# EAGLE design Radio_RPIZero (EAGLE 9.2.0)
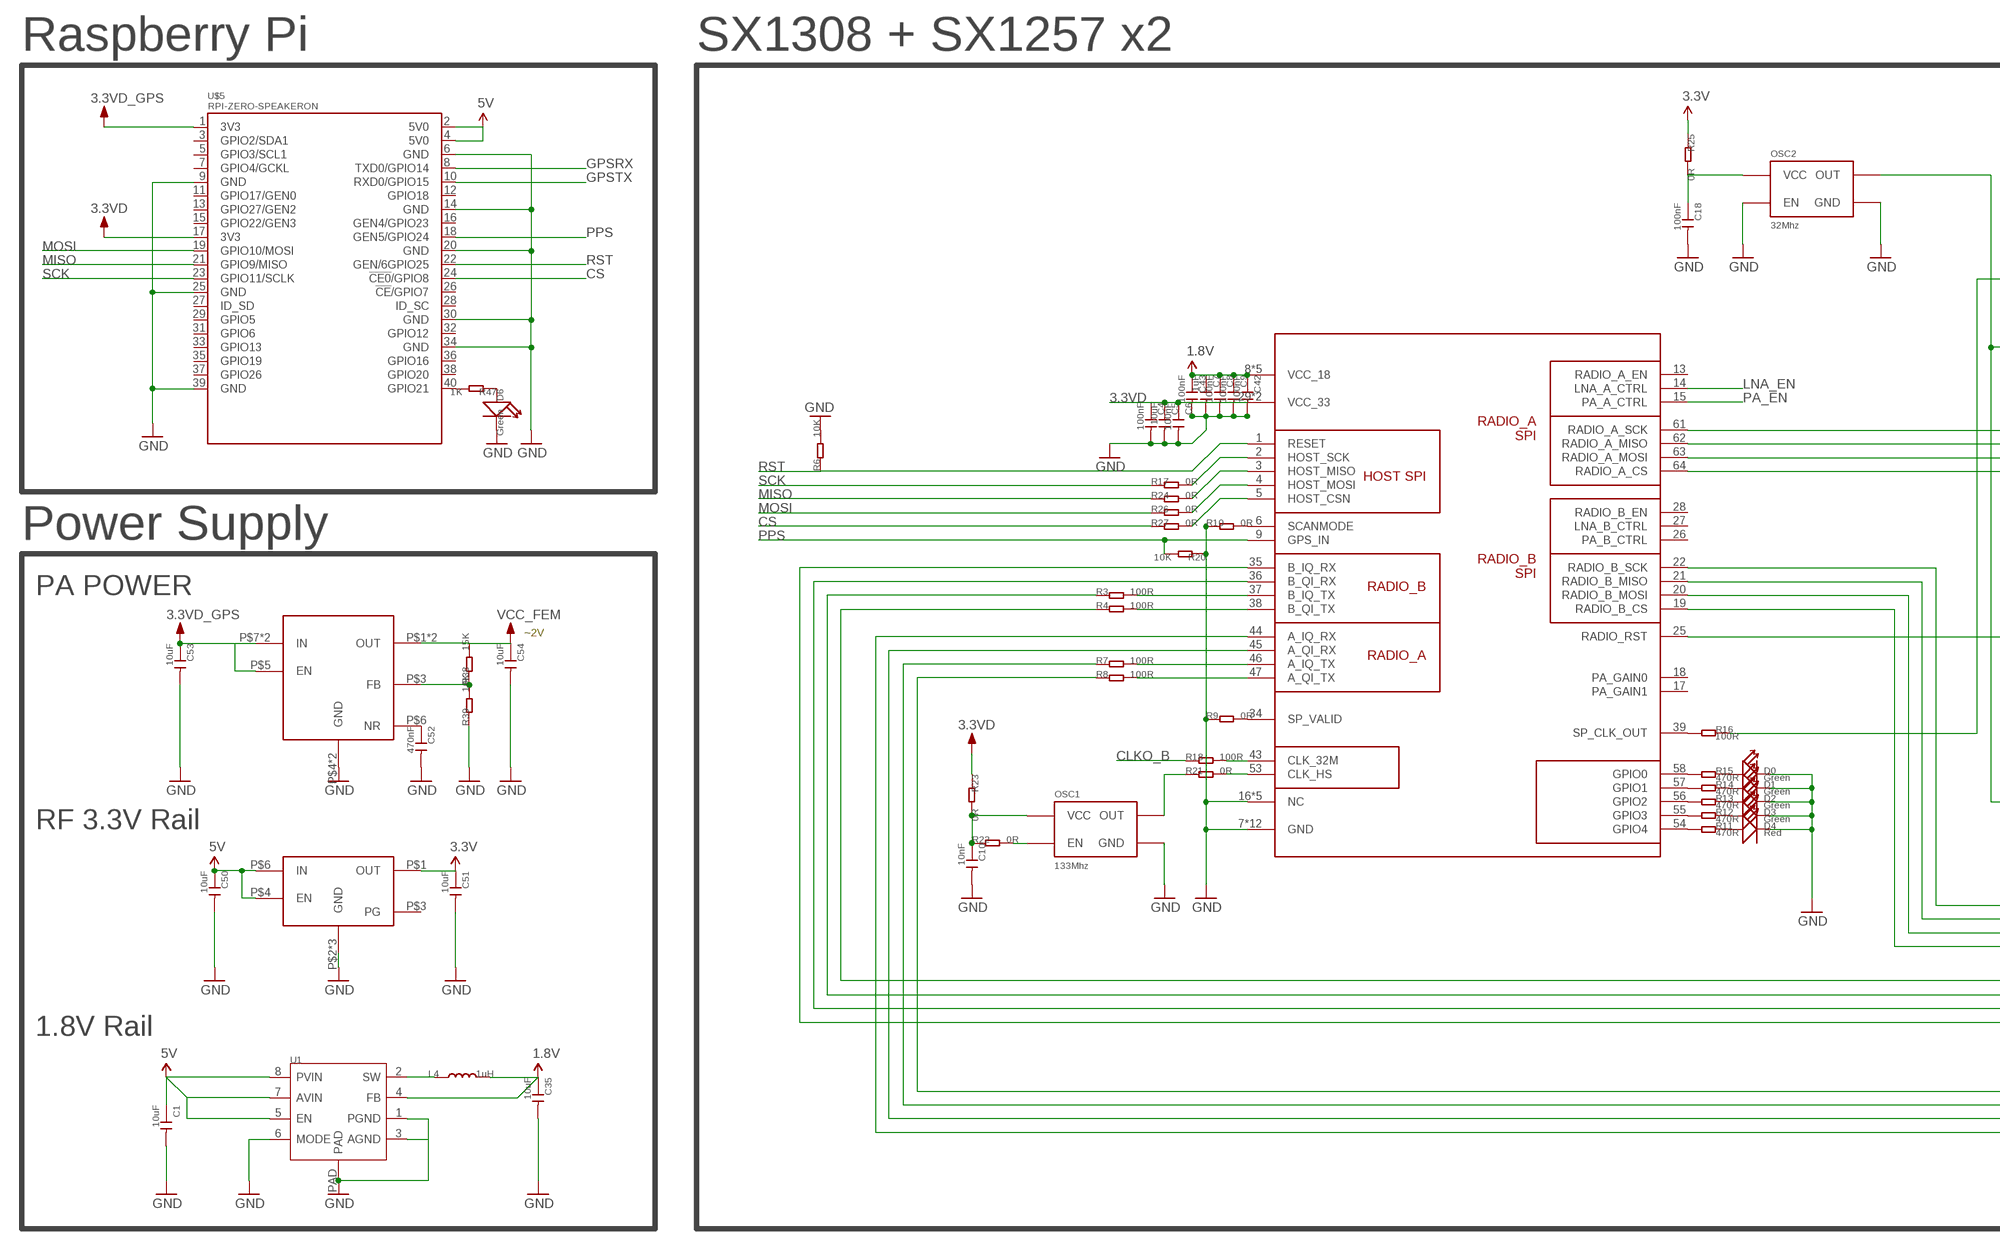
[diagram p0: schematic, sheet 1, part 1 of 2]
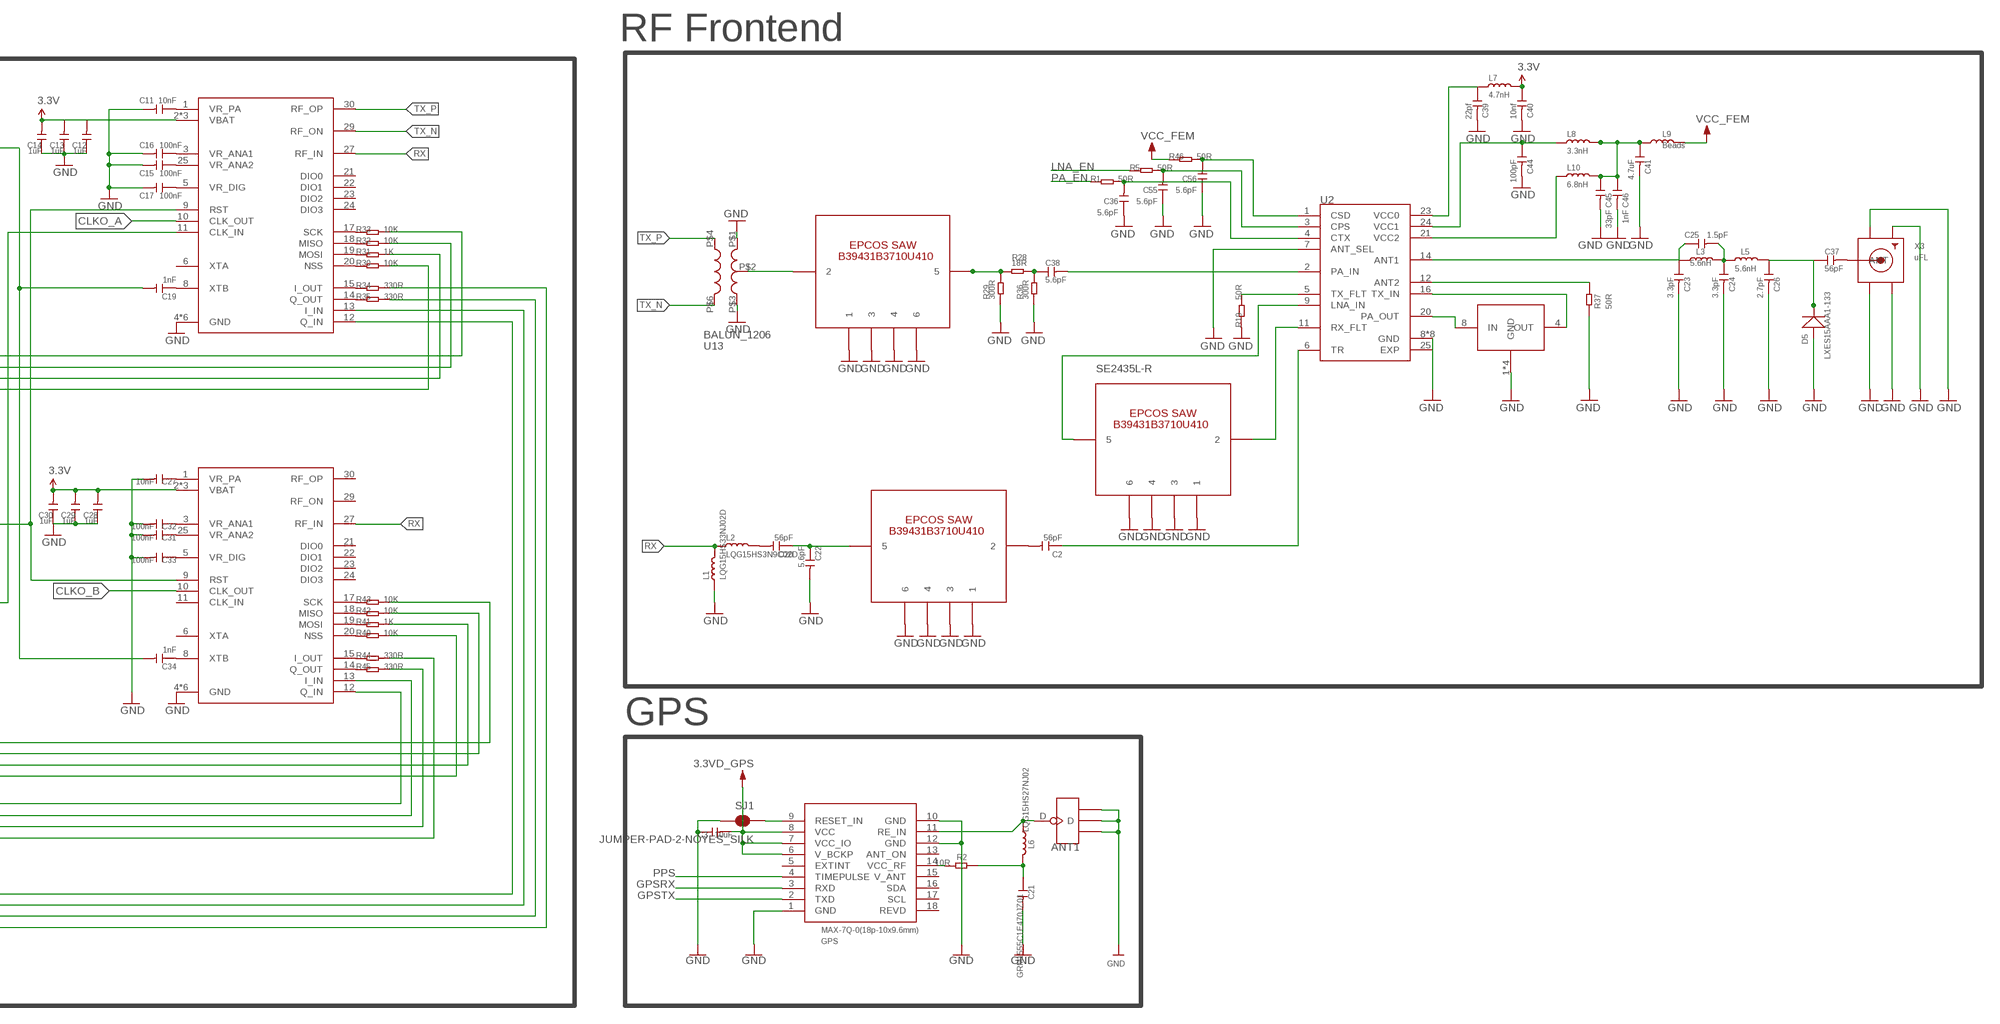
[diagram p1: schematic, sheet 1, part 2 of 2]

## Parts
ANT1  ANTENNA-U-FL  [4P-U-FL]
C1  10uF  CAP-0603  [C0603@1]
C2  56pF  CAP-0402  [C0402@1]
C3  10uF  C-0603  [C0603]
C4  100nF  CAP-0402  [C0402@1]
C5  10uF  CAP-0402  [C0402@1]
C6  100nF  CAP-0402  [C0402@1]
C7  1uF  CAP-0402  [C0402@1]
C8  100nF  CAP-0402  [C0402@1]
C9  100nF  CAP-0402  [C0402@1]
C10  10nF  CAP-0402  [C0402@1]
C11  10nF  CAP-0402  [C0402@1]
C12  1uF  CAP-0402  [C0402@1]
C13  1uF  CAP-0402  [C0402@1]
C14  1uF  CAP-0402  [C0402@1]
C15  100nF  CAP-0402  [C0402@1]
C16  100nF  CAP-0402  [C0402@1]
C17  100nF  CAP-0402  [C0402@1]
C18  100nF  CAP-0402  [C0402@1]
C19  1nF  CAP-0402  [C0402@1]
C20  56pF  CAP-0402  [C0402@1]
C21  GRM1555C1E470JZ01  C-0402  [C0402]
C22  5.6pF  CAP-0402  [C0402@1]
C23  3.3pF  CAP-0402  [C0402@1]
C24  3.3pF  CAP-0402  [C0402@1]
C25  1.5pF  CAP-0402  [C0402@1]
C26  2.7pF  CAP-0402  [C0402@1]
C27  10nF  CAP-0402  [C0402@1]
C28  1uF  CAP-0402  [C0402@1]
C29  1uF  CAP-0402  [C0402@1]
C30  1uF  CAP-0402  [C0402@1]
C31  100nF  CAP-0402  [C0402@1]
C32  100nF  CAP-0402  [C0402@1]
C33  100nF  CAP-0402  [C0402@1]
C34  1nF  CAP-0402  [C0402@1]
C35  10uF  CAP-0603  [C0603@1]
C36  5.6pF  CAP-0402  [C0402@1]
C37  56pF  CAP-0402  [C0402@1]
C38  5.6pF  CAP-0402  [C0402@1]
C39  22pf  CAP-0402  [C0402@1]
C40  10nf  CAP-0402  [C0402@1]
C41  4.7uF  CAP-0402  [C0402@1]
C42  100nF  CAP-0402  [C0402@1]
C43  100nF  CAP-0402  [C0402@1]
C44  100pF  CAP-0402  [C0402@1]
C45  33pF  CAP-0402  [C0402@1]
C46  1nF  CAP-0402  [C0402@1]
C50  10uF  CAP-0603  [C0603@1]
C51  10uF  CAP-0603  [C0603@1]
C52  470nF  CAP-0402  [C0402@1]
C53  10uF  CAP-0402  [C0402@1]
C54  10uF  CAP-0402  [C0402@1]
C55  5.6pF  CAP-0402  [C0402@1]
C56  5.6pF  CAP-0402  [C0402@1]
D0  Green  LED-0603  [LED-0603@1]
D1  Green  LED-0603  [LED-0603@1]
D2  Green  LED-0603  [LED-0603@1]
D3  Green  LED-0603  [LED-0603@1]
D4  Red  LED-0603  [LED-0603@1]
D5  LXES15AAA1-133  D  [C0402]
D6  Green  LED'0603'  [LED-0603]
GPS  MAX-7Q-0(18p-10x9.6mm)  MODULE-GPS-SMD-MAX-7Q-0(18P-9.6X10MM)  [GPS18P-SMD-1.1-10X9.6MM]
L1  LQG15HS33NJ02D  INDUCTOR/FERRITE-BEAD-0402  [L0402@1]
L2  LQG15HS3N9C02D  INDUCTOR/FERRITE-BEAD-0402  [L0402@1]
L3  5.6nH  INDUCTOR/FERRITE-BEAD-0402  [L0402@1]
L4  1uH  L'1616BZ'  [1616BZ]
L5  5.6nH  INDUCTOR/FERRITE-BEAD-0402  [L0402@1]
L6  LQG15HS27NJ02  L'0402'  [L0402]
L7  4.7nH  INDUCTOR/FERRITE-BEAD-0402  [L0402@1]
L8  3.3nH  INDUCTOR/FERRITE-BEAD-0402  [L0402@1]
L9  Beads  INDUCTOR/FERRITE-BEAD-0402  [L0402@1]
L10  6.8nH  INDUCTOR/FERRITE-BEAD-0402  [L0402@1]
OSC1  133Mhz  OSCILLATOR3225  [CRYSTAL-OSC-SMD-2.0X2.5]
OSC2  32Mhz  OSCILLATOR  [CRYSTAL-OSC-SMD-3.2X2.5]
R1  50R  R-0402  [R0402]
R2  10R  R-0402  [R0402]
R3  100R  R-0402  [R0402]
R4  100R  R-0402  [R0402]
R5  50R  R-0402  [R0402]
R6  10K  R-0402  [R0402]
R7  100R  R-0402  [R0402]
R8  100R  R-0402  [R0402]
R9  0R  R-0402  [R0402]
R10  0R  R-0402  [R0402]
R11  470R  R-0402  [R0402]
R12  470R  R-0402  [R0402]
R13  470R  R-0402  [R0402]
R14  470R  R-0402  [R0402]
R15  470R  R-0402  [R0402]
R16  100R  R-0402  [R0402]
R17  0R  R-0402  [R0402]
R18  100R  R-0402  [R0402]
R19  50R  R-0402  [R0402]
R20  10K  R-0402  [R0402]
R21  0R  R-0402  [R0402]
R22  0R  R-0402  [R0402]
R23  0R  R-0402  [R0402]
R24  0R  R-0402  [R0402]
R25  0R  R-0402  [R0402]
R26  0R  R-0402  [R0402]
R27  0R  R-0402  [R0402]
R28  18R  R-0402  [R0402]
R29  300R  R-0402  [R0402]
R30  10K  R-0402  [R0402]
R31  1K  R-0402  [R0402]
R32  10K  R-0402  [R0402]
R33  10K  R-0402  [R0402]
R34  330R  R-0402  [R0402]
R35  330R  R-0402  [R0402]
R36  300R  R-0402  [R0402]
R37  50R  R-0402  [R0402]
R38  15K  R-0402  [R0402]
R39  10K  R-0402  [R0402]
R40  10K  R-0402  [R0402]
R41  1K  R-0402  [R0402]
R42  10K  R-0402  [R0402]
R43  10K  R-0402  [R0402]
R44  330R  R-0402  [R0402]
R45  330R  R-0402  [R0402]
R46  50R  R-0402  [R0402]
R47  1K  R-0402  [R0402]
SJ1  JUMPER-PAD-2-NOYES_SILK  [PAD-JUMPER-2-NO_YES_SILK]
U1  PMIC-ETA3410D2I-T(DFN8-2X2)WSON  [WSON]
U2  SE2435L-R  [QFN50P400X400X90-25N]
U13  BALUN_1206  [BALUN_1206]
U$1  SX1301  [QFN64G-0.5-9X9MM]
U$2  SX1255  [QFN32G-0.5-5X5MM]
U$3  SX1255  [QFN32G-0.5-5X5MM]
U$4  B39921B3728U410  EPCOS_SAW_FILTER  [EPCOS_SAW_FILTER]
U$5  RPI-ZERO-SPEAKERON  [RASPBERRYPI_BASTELSTUBE_V13_RASPI_BOARD_B+_FULL]
U$6  LP5912  [WSON6]
U$7  B39921B3728U410  EPCOS_SAW_FILTER  [EPCOS_SAW_FILTER]
U$8  B39921B3728U410  EPCOS_SAW_FILTER  [EPCOS_SAW_FILTER]
U$9  TPS7A8101  [VSON8]
U$10  0915LP15B026  [0915LP15B026]
X3  uFL  SMACONNECTOR_EDGE_UFL  [SMA_EDGELAUNCH_UFL]

## Nets
1.8V: C7.1 C8.1 C9.1 C35.1 C42.1 C43.1 L4.2 U1.4(FB) U$1.8(VCC_18) U$1.12(VCC_18) U$1.23(VCC_18) U$1.42(VCC_18) U$1.60(VCC_18)
3.3V: C12.2 C13.2 C14.2 C28.2 C29.2 C30.2 C40.1 C51.1 L7.2 R25.1 U$2.2(VBAT) U$2.16(VBAT) U$2.32(VBAT) U$3.2(VBAT) U$3.16(VBAT) U$3.32(VBAT) U$6.P$1(OUT)
3.3VD: C4.1 C5.1 C6.1 R23.1 U$1.29(VCC_33) U$1.52(VCC_33) U$5.17(3V3)
3.3VD_GPS: C3.2 C53.1 GPS.6(V_BCKP) GPS.7(VCC_IO) GPS.8(VCC) U$5.1(3V3) U$9.P$5(EN) U$9.P$7(IN) U$9.P$8(IN)
5V: C1.1 C50.1 U1.5(EN) U1.7(AVIN) U1.8(PVIN) U$5.2(5V0) U$5.4(5V0) U$6.P$4(EN) U$6.P$6(IN)
CLKO_A: U$2.10(CLK_OUT)
CLKO_B: R18.1 U$3.10(CLK_OUT)
CS: R27.1 U$5.24(!CE0!/GPIO8)
FEWF: D4.+ R11.2
GND: ANT1.GND1 ANT1.GND2 ANT1.GND3 C1.2 C3.1 C4.2 C5.2 C6.2 C7.2 C8.2 C9.2 C10.2 C11.2 C12.1 C13.1 C14.1 C15.2 C16.2 C17.2 C18.2 C21.2 C22.2 C23.2 C24.2 C26.2 C27.2 C28.1 C29.1 C30.1 C31.2 C32.2 C33.2 C35.2 C36.1 C39.2 C40.2 C41.2 C42.2 C43.2 C44.2 C45.2 C46.2 C50.2 C51.2 C52.2 C53.2 C54.2 C55.1 C56.1 D0.- D1.- D2.- D3.- D4.- D5.1(+) D6.- GPS.1(GND) GPS.10(GND) GPS.12(GND) L1.1 OSC1.2(GND) OSC2.P$1(EN) OSC2.P$2(GND) R6.2 R9.1 R10.1 R19.1 R20.1 R29.1 R36.1 R37.2 R39.1 SJ1.2 U1.1(PGND) U1.3(AGND) U1.6(MODE) U1.PAD U2.7(ANT_SEL) U2.8(GND) U2.10(GND) U2.13(GND) U2.15(GND) U2.17(GND) U2.18(GND) U2.19(GND) U2.22(GND) U2.25(EXP) U13.P$1(GND_1) U13.P$3(GND_2) U$1.7(GND) U$1.10(GND) U$1.11(GND) U$1.16(NC) U$1.24(GND) U$1.30(GND) U$1.31(GND) U$1.32(NC) U$1.33(NC) U$1.40(GND) U$1.41(GND) U$1.48(NC) U$1.49(NC) U$1.50(GND) U$1.51(GND) U$1.59(GND) U$1.65(GND) U$2.4(GND) U$2.7(GND) U$2.26(GND) U$2.28(GND) U$2.31(GND) U$2.33(GND) U$3.4(GND) U$3.7(GND) U$3.26(GND) U$3.28(GND) U$3.31(GND) U$3.33(GND) U$4.P$1 U$4.P$3 U$4.P$4 U$4.P$6 U$5.6(GND) U$5.9(GND) U$5.14(GND) U$5.20(GND) U$5.25(GND) U$5.30(GND) U$5.34(GND) U$5.39(GND) U$6.P$2(GND) U$6.P$5(GND) U$6.PAD(GND) U$7.P$1 U$7.P$3 U$7.P$4 U$7.P$6 U$8.P$1 U$8.P$3 U$8.P$4 U$8.P$6 U$9.P$4(GND) U$9.PAD(GND) U$10.1(GND) U$10.3(GND) U$10.5(GND) U$10.7(GND) X3.GND@1(GND1) X3.GND@2(GND2) X3.GND@3(GND3) X3.GND@4(GND4)
GPSRX: GPS.3(RXD) U$5.8(TXD0/GPIO14)
GPSTX: GPS.2(TXD) U$5.10(RXD0/GPIO15)
LNA_EN: R5.1 U$1.14(LNA_A_CTRL)
MISO: R24.1 U$5.21(GPIO9/MISO)
MOSI: R26.1 U$5.19(GPIO10/MOSI)
N$1: R30.1 U$2.20(NSS)
N$2: R45.2 U$1.36(B_QI_RX)
N$3: R3.2 U$1.37(B_IQ_TX)
N$4: R4.2 U$1.38(B_QI_TX)
N$5: R34.2 U$1.44(A_IQ_RX)
N$6: R7.2 U$1.46(A_IQ_TX)
N$7: R8.2 U$1.47(A_QI_TX)
N$8: R35.2 U$1.45(A_QI_RX)
N$9: R9.2 U$1.34(SP_VALID)
N$10: R10.2 U$1.6(SCANMODE)
N$11: C20.2 L2.2
N$12: R11.1 U$1.54(GPIO4)
N$13: R12.1 U$1.55(GPIO3)
N$14: R13.1 U$1.56(GPIO2)
N$15: R14.1 U$1.57(GPIO1)
N$16: R15.1 U$1.58(GPIO0)
N$17: U2.20(PA_OUT) U$10.8(IN)
N$18: D3.+ R12.2
N$19: D1.+ R14.2
N$20: D0.+ R15.2
N$21: D2.+ R13.2
N$22: R16.1 U$1.39(SP_CLK_OUT)
N$23: U13.P$2(UNBALANCE) U$7.P$2
N$25: L4.1 U1.2(SW)
N$26: R47.2 U$5.40(GPIO21)
N$27: C21.1 L6.1 R2.1
N$28: C36.2 R1.2 U2.4(CTX)
N$29: C19.1 U$2.8(XTB)
N$30: R21.2 U$1.53(CLK_HS)
N$31: OSC1.3(OUT) R21.1
N$32: OSC1.1(EN) R22.2
N$33: C10.1 OSC1.4(VCC) R22.1 R23.2
N$34: GPS.14(VCC_RF) R2.2
N$35: C11.1 U$2.1(VR_PA)
N$36: C18.1 OSC2.P$4(VCC) R25.2
N$37: C19.2 C34.2 OSC2.P$3(OUT)
N$38: C15.1 U$2.25(VR_ANA2)
N$39: C16.1 U$2.3(VR_ANA1)
N$40: C17.1 U$2.5(VR_DIG)
N$41: ANT1.D GPS.11(RE_IN) L6.2
N$42: R19.2 U2.5(TX_FLT)
N$43: R17.2 U$1.2(HOST_SCK)
N$44: C20.1 C22.1 U$4.P$5
N$45: R18.2 U$1.43(CLK_32M)
N$46: C2.2 U$4.P$2
N$47: GPS.9(RESET_IN) SJ1.1
N$48: R24.2 U$1.3(HOST_MISO)
N$50: R26.2 U$1.4(HOST_MOSI)
N$51: C55.2 R5.2 U2.3(CPS)
N$52: R28.1 R29.2 U$7.P$5
N$53: U2.11(RX_FLT) U$8.P$2
N$54: U2.9(LNA_IN) U$8.P$5
N$56: R34.1 U$2.15(I_OUT)
N$57: R35.1 U$2.14(Q_OUT)
N$58: C27.1 U$3.1(VR_PA)
N$59: C31.1 U$3.25(VR_ANA2)
N$60: C32.1 U$3.3(VR_ANA1)
N$61: C33.1 U$3.5(VR_DIG)
N$62: C34.1 U$3.8(XTB)
N$64: C2.1 U2.6(TR)
N$65: C23.1 C25.1 L3.1 U2.14(ANT1)
N$66: C24.1 C25.2 L3.2 L5.1
N$67: C26.1 C37.1 D5.2(-) L5.2
N$68: C38.1 R28.2 R36.2
N$69: C38.2 U2.2(PA_IN)
N$70: C37.2 X3.P(ANT)
N$71: C39.1 L7.1 U2.23(VCC0)
N$72: R37.1 U2.12(ANT2)
N$73: U2.16(TX_IN) U$10.4(OUT)
N$74: C41.1 C45.1 C46.1 L8.2 L9.1 L10.2
N$75: C44.1 L8.1 U2.24(VCC1)
N$76: D6.+ R47.1
N$77: L10.1 U2.21(VCC2)
N$78: R44.1 U$3.15(I_OUT)
N$79: R45.1 U$3.14(Q_OUT)
N$80: R33.2 U$1.61(RADIO_A_SCK)
N$81: R32.2 U$1.62(RADIO_A_MISO)
N$82: R31.2 U$1.63(RADIO_A_MOSI)
N$83: R30.2 U$1.64(RADIO_A_CS)
N$84: R43.2 U$1.22(RADIO_B_SCK)
N$85: R42.2 U$1.21(RADIO_B_MISO)
N$86: R41.2 U$1.20(RADIO_B_MOSI)
N$87: R40.2 U$1.19(RADIO_B_CS)
N$88: U$1.25(RADIO_RST) U$2.9(RST) U$3.9(RST)
N$89: R16.2 U$2.11(CLK_IN)
N$90: R44.2 U$1.35(B_IQ_RX)
N$91: R7.1 U$2.13(I_IN)
N$92: R3.1 U$3.13(I_IN)
N$93: R4.1 U$3.12(Q_IN)
N$94: R8.1 U$2.12(Q_IN)
N$95: C56.2 R46.2 U2.1(CSD)
N$96: R38.1 R39.2 U$9.P$3(FB)
N$97: R27.2 U$1.5(HOST_CSN)
N$98: C52.1 U$9.P$6(NR)
N$100: R31.1 U$2.19(MOSI)
N$101: R32.1 U$2.18(MISO)
N$102: R33.1 U$2.17(SCK)
N$103: R40.1 U$3.20(NSS)
N$104: R41.1 U$3.19(MOSI)
N$105: R42.1 U$3.18(MISO)
N$106: R43.1 U$3.17(SCK)
PA_EN: R1.1 U$1.15(PA_A_CTRL)
PPS: GPS.4(TIMEPULSE) R20.2 U$1.9(GPS_IN) U$5.18(GEN5/GPIO24)
RST: R6.1 U$1.1(RESET) U$5.22(GEN/6GPIO25)
RX: L1.2 L2.1 U$2.27(RF_IN) U$3.27(RF_IN)
SCK: R17.1 U$5.23(GPIO11/SCLK)
TX_N: U13.P$6(BALANCE_2) U$2.29(RF_ON)
TX_P: U13.P$4(BALANCE_1) U$2.30(RF_OP)
VCC_FEM: C54.1 L9.2 R38.2 R46.1 U$9.P$1(OUT) U$9.P$2(OUT)
Unconnected: GPS.5(EXTINT) GPS.13(ANT_ON) GPS.15(V_ANT) GPS.16(SDA) GPS.17(SCL) GPS.18(REVD) U$1.13(RADIO_A_EN) U$1.17(PA_GAIN1) U$1.18(PA_GAIN0) U$1.26(PA_B_CTRL) U$1.27(LNA_B_CTRL) U$1.28(RADIO_B_EN) U$2.6(XTA) U$2.21(DIO0) U$2.22(DIO1) U$2.23(DIO2) U$2.24(DIO3) U$3.6(XTA) U$3.11(CLK_IN) U$3.21(DIO0) U$3.22(DIO1) U$3.23(DIO2) U$3.24(DIO3) U$3.29(RF_ON) U$3.30(RF_OP) U$5.3(GPIO2/SDA1) U$5.5(GPIO3/SCL1) U$5.7(GPIO4/GCKL) U$5.11(GPIO17/GEN0) U$5.12(GPIO18) U$5.13(GPIO27/GEN2) U$5.15(GPIO22/GEN3) U$5.16(GEN4/GPIO23) U$5.26(!CE!/GPIO7) U$5.27(ID_SD) U$5.28(ID_SC) U$5.29(GPIO5) U$5.31(GPIO6) U$5.32(GPIO12) U$5.33(GPIO13) U$5.35(GPIO19) U$5.36(GPIO16) U$5.37(GPIO26) U$5.38(GPIO20) U$6.P$3(PG)

## Notes on the sheet
- Raspberry Pi | SX1308 + SX1257 x2 | RF Frontend
- Power Supply
- PA POWER
- ~2V
- RF 3.3V Rail
- GPS
- 1.8V Rail

## Library data of the parts
ANT1 = Connector :ANTENNA-U-FL
C1 C2 C4-C20 C22-C46 C50-C56 = Discrete:CAP: Ceramic Capacitors
C3 C21 = Discrete:C*: Ceramic Capacitors
D0 D1-D4 = Discrete:LED
D5 = Discrete:D*
D6 = Discrete:LED*
GPS = Seeed-OPL-Moudle:MODULE-GPS-SMD-MAX-7Q-0(18P-9.6X10MM): 317050009; MPN: MAX-7Q-0
L1-L3 L5 L7-L10 = Discrete:INDUCTOR/FERRITE-BEAD
L4 L6 = Discrete:L*
OSC1 OSC2 = SparkFun-FreqCtrl:OSCILLATOR: Generic 5x3 and 7x5 oscillators
R1-R47 = Discrete:R*
SJ1 = SparkFun-Passives:JUMPER-PAD-2-NO
U1 = Seeed-OPL-ic:PMIC-ETA3410D2I-T(DFN8-2X2): 310030161
U2 = SE2435L-R:SE2435L-R: LNA/PA RF Front End 16dB 2dB 24-Pin QFN EP T/R; DESCRIPTION: LNA/PA RF Front End 16dB 2dB 24-Pin QFN EP T/R; DIGI-KEY_PART_NUMBER: 863-1349-1-ND; DIGI-KEY_PURCHASE_URL: https://www.digikey.tw/product-detail/en/skyworks-solutions-inc/SE2435L-R/863-1349-1-ND/2745468?WT.z_cid=ref_snapeda&utm_source=snapeda&utm_medium=aggregator&utm_campaign=buynow; MF: Skyworks Solutions; MP: SE2435L-R; PACKAGE: QFN-24 Skyworks Solutions
U13 = SparkFun-RF:BALUN_1206
U$1 = Seeed-OPL-ic:SX1301
U$2 U$3 = Seeed-OPL-ic:SX1255
U$4 U$7 U$8 = Ava:EPCOS_SAW_FILTER
U$5 = jos-ph:RPI-ZERO-SPEAKERON: Raspberry Pi Zero for SPEAKER ON
U$6 = IC:LP5912
U$9 = IC:TPS7A8101
U$10 = SparkFun-RF:0915LP15B026
X3 = microbuilder:SMACONNECTOR: SMA Connector 90° DIP SMA Connector, 50 Ohm (4UConnector: 07259)

## Board
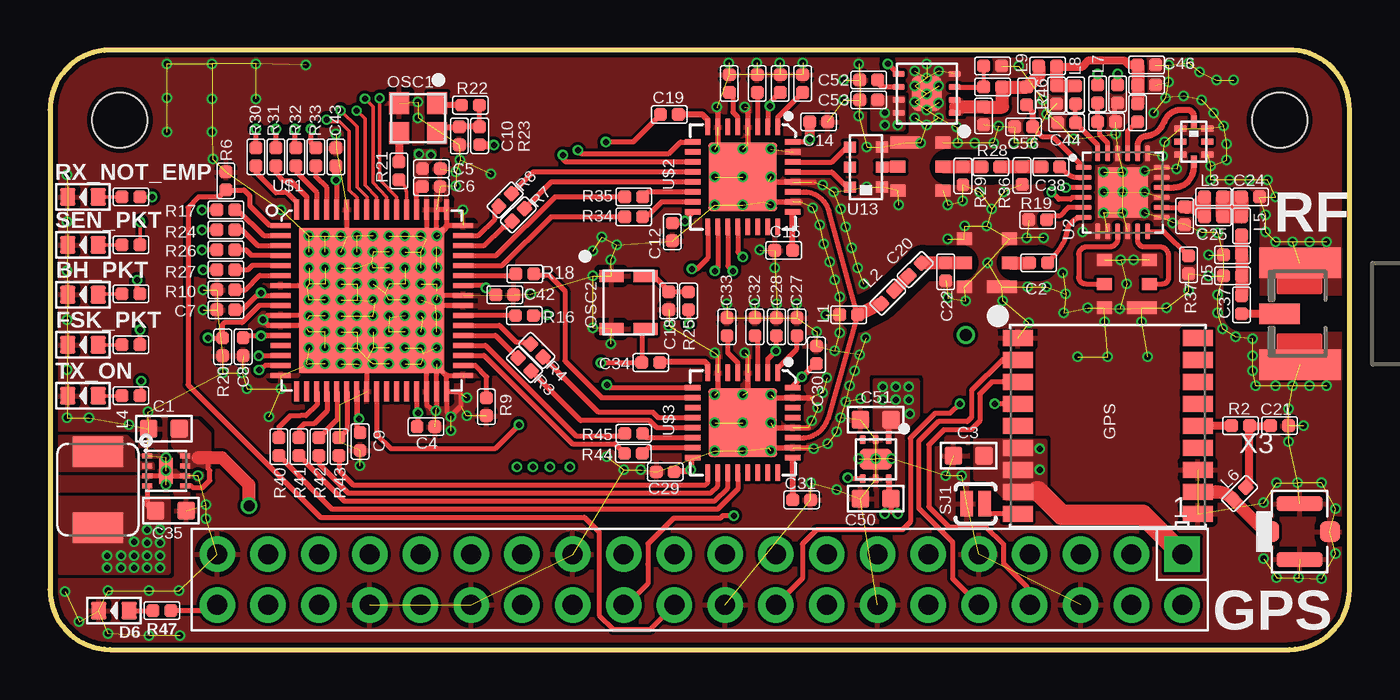
[diagram p2: board, top side]
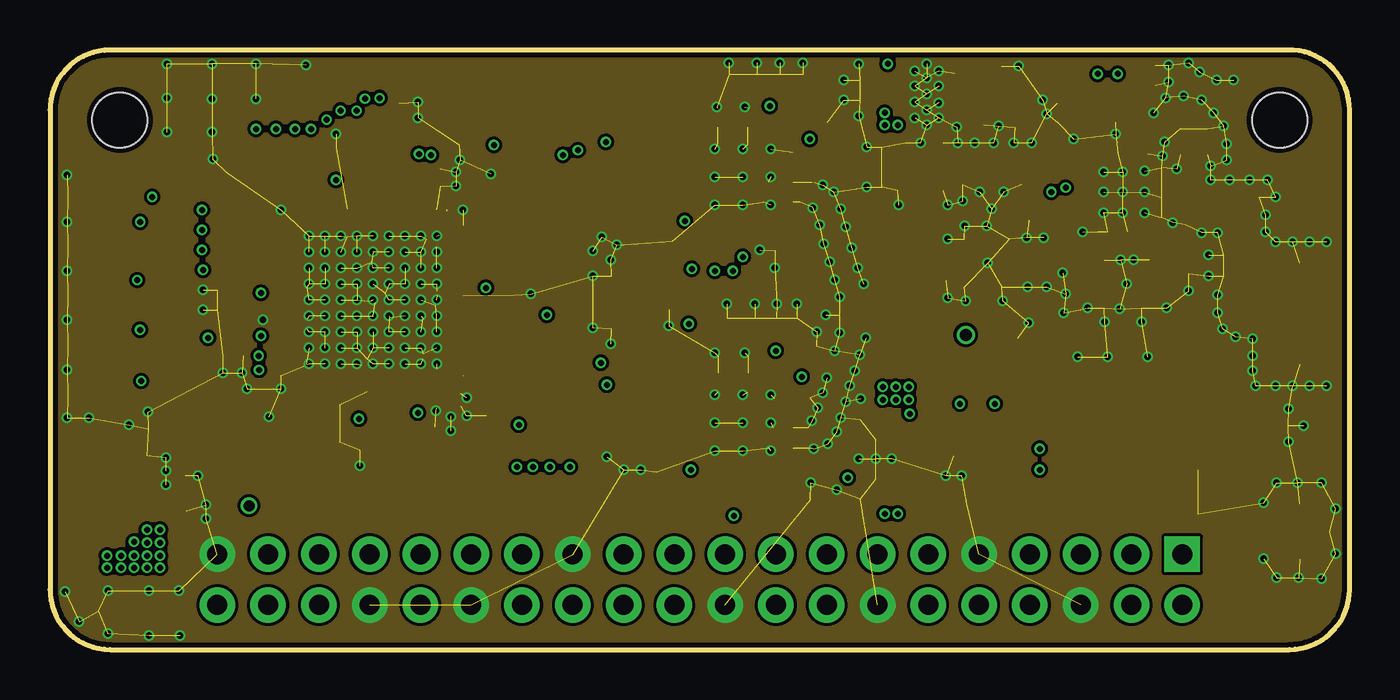
[diagram p3: board, inner layer $GND]
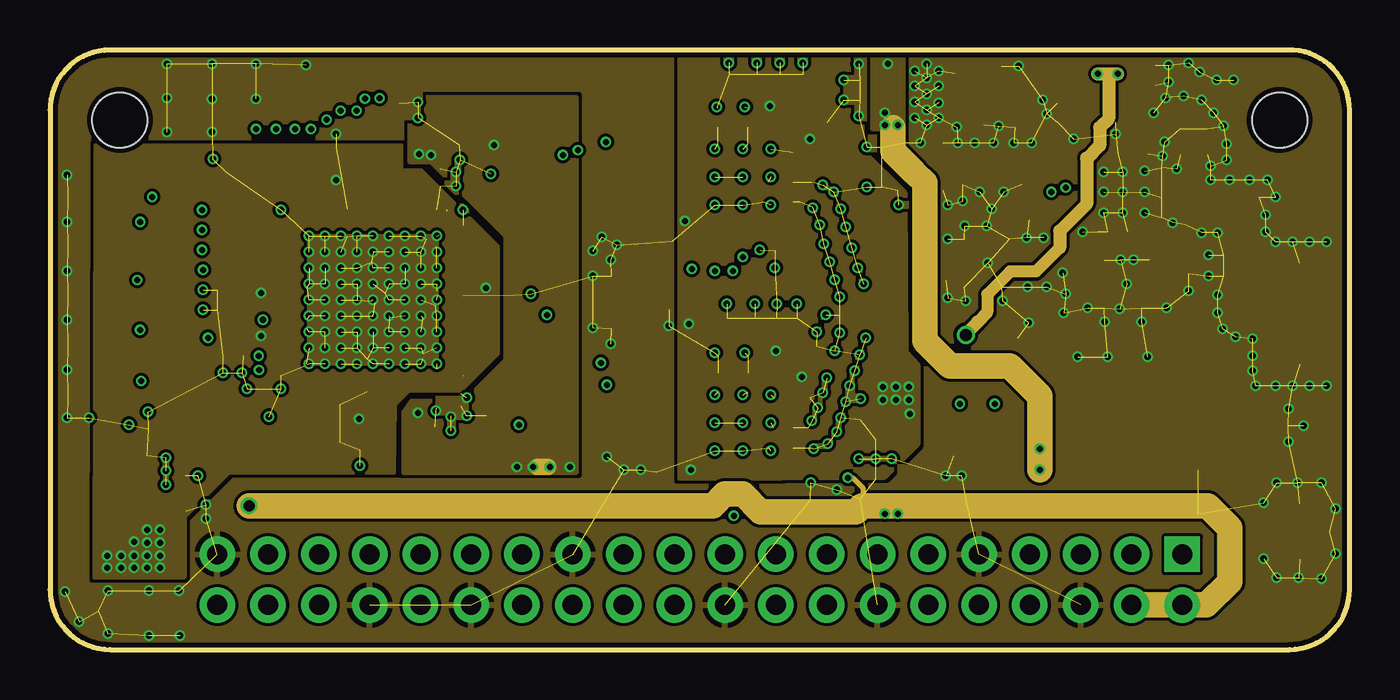
[diagram p4: board, inner layer $VCC]
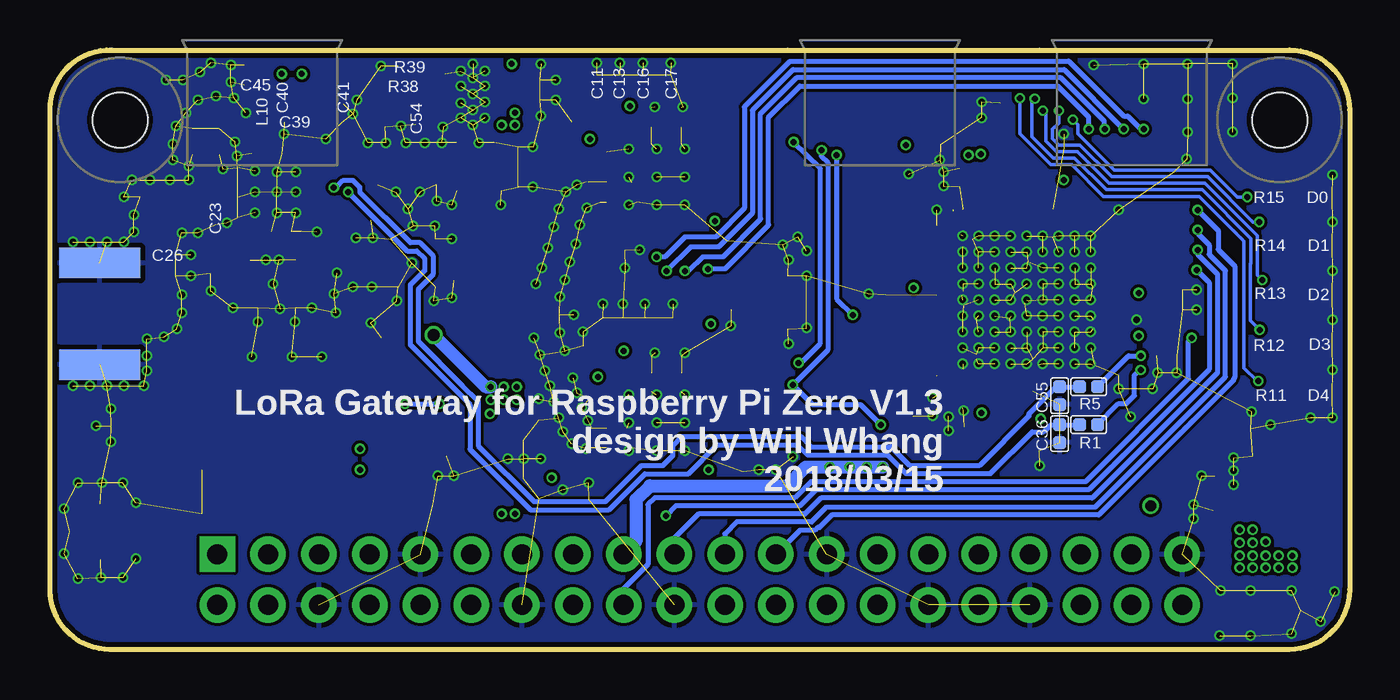
[diagram p5: board, bottom side, seen from below]

Size 65 x 30 mm. Coordinates in mm from the lower left corner, seen from the top.
Outline: 65,3 65,27 arc92 61.9,30 3,30 arc90 0,27 0,3 arc90 3,0 62,0 arc90 65,3
Copper layers (1*2*15*16): Top 0.035mm / dielectric 0.2mm / $GND 0.0175mm / dielectric 0.3mm / $VCC 0.0175mm / dielectric 0.2mm / Bottom 0.035mm
Design rules "SeeedStudio_4layer_DRU_no_angle_20140221 *": minimum track width 6mil, minimum drill 0.3mm, track to track 6mil, track to pad 8mil, pad to pad 8mil, via to via 8mil, smd to smd 0mil, copper to edge 10mil, drill to drill 8mil, minimum pad ring 6mil, minimum via ring 4mil, stop-mask expansion 4mil, vias tented up to drill 25mil, thermal gap 10mil
tRestrict: 31 lines

### Footprints (pad centres in the part's own frame; a part is rotated, then mirrored left to right if it is on the bottom)
4P-U-FL = smd 1.016 x 1.016: D -1.524,0; GND3 1.524,0 | smd 2.286 x 0.762: GND1 0,1.397; GND2 0,-1.397
C0603@1 = smd 0.889 x 0.889: 1 -0.762,0; 2 0.762,0
C0402@1 = smd 0.635 x 0.635: 1 -0.445,0; 2 0.445,0
C0603 = smd 0.889 x 0.889: 1 -0.762,0; 2 0.762,0
C0402 = smd 0.635 x 0.635: 1 -0.445,0; 2 0.445,0
LED-0603@1 = smd 0.762 x 0.889: + -0.762,0; - 0.762,0
LED-0603 = smd 0.762 x 0.889: + -0.762,0; - 0.762,0
GPS18P-SMD-1.1-10X9.6MM = smd 1.5 x 0.8: 1 -4.5,4.4; 2 -4.5,3.3; 3 -4.5,2.2; 4 -4.5,1.1; 5 -4.5,0; 6 -4.5,-1.1; 7 -4.5,-2.2; 8 -4.5,-3.3; 9 -4.5,-4.4; 10 4.5,-4.4; 11 4.5,-3.3; 12 4.5,-2.2; 13 4.5,-1.1; 14 4.5,0; 15 4.5,1.1; 16 4.5,2.2; 17 4.5,3.3; 18 4.5,4.4
L0402@1 = smd 0.635 x 0.635: 1 -0.445,0; 2 0.445,0
1616BZ = smd 1.524 x 2.54: 1 -1.905,0; 2 1.905,0
L0402 = smd 0.635 x 0.635: 1 -0.445,0; 2 0.445,0
CRYSTAL-OSC-SMD-2.0X2.5 = smd 1 x 1.1: 1 -0.95,-0.75; 2 0.95,-0.75; 3 0.95,0.75; 4 -0.95,0.75
CRYSTAL-OSC-SMD-3.2X2.5 = smd 0.6 x 1.2: P$1 -1.325,-0.85; P$2 1.325,-0.85; P$3 1.325,0.85; P$4 -1.325,0.85
R0402 = smd 0.635 x 0.635: 1 -0.445,0; 2 0.445,0
PAD-JUMPER-2-NO_YES_SILK = smd 0.635 x 1.27: 1 -0.45,0; 2 0.45,0
WSON = smd 0.25 x 0.5: 1 -0.75,-0.95; 2 -0.25,-0.95; 3 0.25,-0.95; 4 0.75,-0.95; 5 0.75,0.95; 6 0.25,0.95; 7 -0.25,0.95; 8 -0.75,0.95 | smd 1.3 x 0.7: PAD 0,0
QFN50P400X400X90-25N = smd 0.8 x 0.27: 1 -1.95,1.25; 2 -1.95,0.75; 3 -1.95,0.25; 4 -1.95,-0.25; 5 -1.95,-0.75; 6 -1.95,-1.25; 13 1.95,-1.25; 14 1.95,-0.75; 15 1.95,-0.25; 16 1.95,0.25; 17 1.95,0.75; 18 1.95,1.25 | smd 0.27 x 0.8: 7 -1.25,-1.95; 8 -0.75,-1.95; 9 -0.25,-1.95; 10 0.25,-1.95; 11 0.75,-1.95; 12 1.25,-1.95; 19 1.25,1.95; 20 0.75,1.95; 21 0.25,1.95; 22 -0.25,1.95; 23 -0.75,1.95; 24 -1.25,1.95 | smd 2.5 x 2.5: 25 0,0
BALUN_1206 = smd 0.55 x 0.6: P$1 -0.6,1.6; P$2 -1.6,1.6; P$3 -2.6,1.6; P$4 -2.6,0; P$5 -1.6,0; P$6 -0.6,0
QFN64G-0.5-9X9MM = smd 1 x 0.25: 1 -4.55,3.75; 2 -4.55,3.25; 3 -4.55,2.75; 4 -4.55,2.25; 5 -4.55,1.75; 6 -4.55,1.25; 7 -4.55,0.75; 8 -4.55,0.25; 9 -4.55,-0.25; 10 -4.55,-0.75; 11 -4.55,-1.25; 12 -4.55,-1.75; 13 -4.55,-2.25; 14 -4.55,-2.75; 15 -4.55,-3.25; 16 -4.55,-3.75; 33 4.55,-3.75; 34 4.55,-3.25; 35 4.55,-2.75; 36 4.55,-2.25; 37 4.55,-1.75; 38 4.55,-1.25; 39 4.55,-0.75; 40 4.55,-0.25; 41 4.55,0.25; 42 4.55,0.75; 43 4.55,1.25; 44 4.55,1.75; 45 4.55,2.25; 46 4.55,2.75; 47 4.55,3.25; 48 4.55,3.75 | smd 0.25 x 1: 17 -3.75,-4.55; 18 -3.25,-4.55; 19 -2.75,-4.55; 20 -2.25,-4.55; 21 -1.75,-4.55; 22 -1.25,-4.55; 23 -0.75,-4.55; 24 -0.25,-4.55; 25 0.25,-4.55; 26 0.75,-4.55; 27 1.25,-4.55; 28 1.75,-4.55; 29 2.25,-4.55; 30 2.75,-4.55; 31 3.25,-4.55; 32 3.75,-4.55; 49 3.75,4.55; 50 3.25,4.55; 51 2.75,4.55; 52 2.25,4.55; 53 1.75,4.55; 54 1.25,4.55; 55 0.75,4.55; 56 0.25,4.55; 57 -0.25,4.55; 58 -0.75,4.55; 59 -1.25,4.55; 60 -1.75,4.55; 61 -2.25,4.55; 62 -2.75,4.55; 63 -3.25,4.55; 64 -3.75,4.55 | smd 7.25 x 7.25: 65 0,0
QFN32G-0.5-5X5MM = smd 0.813 x 0.279: 1 -2.5,1.75; 2 -2.5,1.25; 3 -2.5,0.75; 4 -2.5,0.25; 5 -2.5,-0.25; 6 -2.5,-0.75; 7 -2.5,-1.25; 8 -2.5,-1.75; 17 2.5,-1.75; 18 2.5,-1.25; 19 2.5,-0.75; 20 2.5,-0.25; 21 2.5,0.25; 22 2.5,0.75; 23 2.5,1.25; 24 2.5,1.75 | smd 0.279 x 0.813: 9 -1.75,-2.5; 10 -1.25,-2.5; 11 -0.75,-2.5; 12 -0.25,-2.5; 13 0.25,-2.5; 14 0.75,-2.5; 15 1.25,-2.5; 16 1.75,-2.5; 25 1.75,2.5; 26 1.25,2.5; 27 0.75,2.5; 28 0.25,2.5; 29 -0.25,2.5; 30 -0.75,2.5; 31 -1.25,2.5; 32 -1.75,2.5 | smd 3.429 x 3.429: 33 0,0
EPCOS_SAW_FILTER = smd 0.6 x 1.5: P$1 1.2,0.75 | smd 0.6 x 0.75: P$2 0,1.125; P$3 -1.2,1.125; P$4 -1.2,-1.125; P$5 0,-1.125; P$6 1.2,-1.125
RASPBERRYPI_BASTELSTUBE_V13_RASPI_BOARD_B+_FULL = drill 1 pad 1.778 square: 1 8.37,25.23 | drill 1 pad 1.778: 2 8.37,27.77; 3 10.91,25.23; 4 10.91,27.77; 5 13.45,25.23; 6 13.45,27.77; 7 15.99,25.23; 8 15.99,27.77; 9 18.53,25.23; 10 18.53,27.77; 11 21.07,25.23; 12 21.07,27.77; 13 23.61,25.23; 14 23.61,27.77; 15 26.15,25.23; 16 26.15,27.77; 17 28.69,25.23; 18 28.69,27.77; 19 31.23,25.23; 20 31.23,27.77; 21 33.77,25.23; 22 33.77,27.77; 23 36.31,25.23; 24 36.31,27.77; 25 38.85,25.23; 26 38.85,27.77; 27 41.39,25.23; 28 41.39,27.77; 29 43.93,25.23; 30 43.93,27.77; 31 46.47,25.23; 32 46.47,27.77; 33 49.01,25.23; 34 49.01,27.77; 35 51.55,25.23; 36 51.55,27.77; 37 54.09,25.23; 38 54.09,27.77; 39 56.63,25.23; 40 56.63,27.77 | hole 2.75: 3.5,3.5; 61.5,3.5
WSON6 = smd 0.45 x 0.3: P$1 0,0; P$2 0,-0.65; P$3 0,-1.3; P$4 1.95,-1.3; P$5 1.95,-0.65; P$6 1.95,0 | smd 1 x 1.6: PAD 0.975,-0.65
VSON8 = smd 0.6 x 0.31: P$1 0,0; P$2 0,-0.65; P$3 0,-1.3; P$4 0,-1.95; P$5 2.8,-1.95; P$6 2.8,-1.3; P$7 2.8,-0.65; P$8 2.8,0 | smd 1.5 x 1.75: PAD 1.4,-0.975
0915LP15B026 = smd 0.3 x 0.6: 1 1.65,1.3; 2 1,1.3; 3 0.35,1.3; 5 0.35,-0.05; 6 1,-0.05; 7 1.65,-0.05 | smd 0.6 x 0.3: 4 0,0.625; 8 2,0.625
SMA_EDGELAUNCH_UFL = smd 4.064 x 1.524: GND@1 2.032,-2.54; GND@2 2.032,2.54 | smd 4.064 x 1.524 bottom: GND@3 2.032,2.54; GND@4 2.032,-2.54 | smd 2.032 x 1.016: P 3.048,0

### Placement (x,y rotation side)
ANT1  62.5,5.9 0 top
C1  5.7,11.05 180 top
C2  49.45,19.35 180 top
C3  45.95,9.7 0 top
C4  18.81,11.15 0 top
C5  19.08,24.06 0 top
C6  19.07,23.16 0 top
C7  8.8,17 180 top
C8  9.66,15.15 270 top
C9  15.51,10.41 270 top
C10  20.47,25.7 270 top
C11  37.65,28.32 90 top
C12  31.13,20.89 90 top
C13  36.52,28.32 270 top
C14  38.45,26.4 180 top
C15  36.7,19.97 180 top
C16  35.37,28.32 90 top
C17  33.97,28.32 90 top
C18  30.95,17.45 270 top
C19  30.98,26.77 180 top
C20  43.28,19.01 225 top
C21  61.5,11.2 0 top
C22  44.8,18.9 270 top
C23  56.75,21.7 270 top
C24  60.05,22.65 0 top
C25  58.2,21.65 0 top
C26  59.15,19.75 180 top
C27  37.36,16.15 90 top
C28  36.34,16.15 270 top
C29  30.77,8.89 0 top
C30  38.34,14.74 270 top
C31  37.6,7.49 0 top
C32  35.26,16.15 90 top
C33  33.86,16.15 90 top
C34  30.05,14.36 180 top
C35  6.05,6.95 0 top
C36  14.5,10.8 90 bottom
C37  59.6,17.25 270 top
C38  50.06,24.15 0 top
C39  52.85,26.4 0 top
C40  53.4,27.8 270 top
C41  50.35,27.75 270 top
C42  22.75,17.75 0 top
C43  14.3,24.65 90 top
C44  50.85,26.35 180 top
C45  54.85,28.25 0 top
C46  54.85,29.25 0 top
C50  41.3,7.55 180 top
C51  41.3,11.5 180 top
C52  40.95,28.5 180 top
C53  40.95,27.5 180 top
C54  46.7,26.7 270 top
C55  14.5,12.7 90 bottom
C56  48.7,26.15 0 top
D0  1.65,22.65 180 top
D1  1.65,20.25 180 top
D2  1.65,17.76 180 top
D3  1.65,15.25 180 top
D4  1.65,12.7 180 top
D5  59.15,18.7 0 top
D6  3.2,1.95 180 top
GPS  52.9,11.2 0 top
L1  39.95,16.75 0 top
L2  41.91,17.64 45 top
L3  58.2,22.65 0 top
L4  2.4,8 270 top
L5  59.6,21.2 270 top
L6  59.51,7.81 225 top
L7  52.4,27.8 90 top
L8  51.3,27.75 90 top
L9  49.9,29.2 180 top
L10  54.4,26.85 90 top
OSC1  18.42,26.59 180 top
OSC2  28.93,17.37 270 top
R1  13.05,11.25 180 bottom
R2  59.55,11.2 180 top
R3  23.74,14.26 135 top
R4  24.35,14.96 135 top
R5  13.05,13.15 180 bottom
R6  8.8,23.45 90 top
R7  23.43,21.76 225 top
R8  22.76,22.49 225 top
R9  21.83,12.14 90 top
R10  8.8,18 0 top
R11  4.05,12.7 180 top
R12  4.05,15.25 180 top
R13  4.05,17.8 180 top
R14  4.05,20.25 180 top
R15  4.05,22.65 180 top
R16  23.73,16.71 0 top
R17  8.8,22 0 top
R18  23.75,18.8 180 top
R19  49.4,21.5 0 top
R20  8.64,15.14 90 top
R21  17.45,23.95 270 top
R22  21.03,27.24 180 top
R23  21.49,25.71 90 top
R24  8.8,21 0 top
R25  31.94,17.44 90 top
R26  8.8,20 0 top
R27  8.8,19 0 top
R28  47.06,24.15 0 top
R29  45.66,23.7 90 top
R30  10.3,24.65 270 top
R31  11.3,24.65 270 top
R32  12.3,24.65 270 top
R33  13.3,24.65 270 top
R34  29.19,21.65 180 top
R35  29.2,22.65 180 top
R36  48.62,23.72 90 top
R37  56.95,19.25 270 top
R38  47.15,28.15 0 top
R39  47.15,29.2 180 top
R40  11.45,10.15 90 top
R41  12.45,10.15 90 top
R42  13.45,10.15 90 top
R43  14.45,10.15 90 top
R44  29.18,9.81 180 top
R45  29.19,10.81 180 top
R46  48.85,27.7 270 top
R47  5.6,1.95 0 top
SJ1  46.3,7.3 180 top
U1  5.8,8.95 270 top
U2  53.66,22.87 0 top
U13  40,22.55 270 top
U$1  16.1,17.47 0 top
U$2  34.65,23.65 270 top
U$3  34.65,11.35 270 top
U$4  46.85,19.35 270 top
U$5  65,30 180 top
U$6  41.95,10.5 270 top
U$7  43.54,24.15 90 top
U$8  53.85,18.3 270 top
U$9  45.25,26.85 180 top
U$10  57.84,24.41 90 top
X3  64.55,16.8 180 top

### Tracks (layer width: path | path; a pad name or v marks a point on that pad's centre or on a via)
1.8V  (via drill 0.3)
  Top 0.203: 10.35,17.75 10.55,17.75 v10.55,17.85 10.55,17.72 10.35,17.72
  Top 0.254: C8.1 9.71,15.72 U$1.12 10.57,15.72 v10.55,15.7 | 10.35,17.72 U$1.8 | U$1.42 21.68,18.22 v21.8,18.1 22.2,17.7 22.36,17.7 C42.1 | C7.1 9.6,17 10.35,17.75 | U1.4 4.85,7.35 4.8,7.3 5.15,6.95 C35.1 | v14.3,23.5 14.35,23.5 U$1.60
  Top 0.28: U$1.23 15.35,11.4 | 15.35,11.4 15.35,10.76 arc90 C9.1 | v15.45,11.55 arc90 15.35,11.4
  Top 0.406: v14.3,23.5 C43.1
  other vias: 4.85,4.7 5.5,6 5.5,4.1 5.5,5.35 5.5,4.7 4.85,6 4.85,5.35 4.85,4.1 4.2,4.1 4.2,4.7 4.2,5.4 3.55,4.7 3.55,4.1 2.85,4.1 2.85,4.7
  pour Top (no thermals): 5.9,7.6 5.9,3.85 0.5,3.85 0.5,7.6
  pour $VCC: 8.95,8.85 17.2,8.85 17.25,12.25 17.95,12.95 20.55,12.95 22.4,14.8 22.4,20.2 18.6,24 17.6,24 17.6,25.25 2.25,25.25 2.25,24.05 2.2,3.6 6.7,3.6 6.75,3.65 6.75,6.65
3.3V  (via drill 0.3, 0.6)
  Top 0.254: U$2.2 35.9,27.16 36,27.16 v36,27.2 36,27.36 C13.2 | U$3.2 35.9,14.55 v36.3,14.95 36.34,14.95 | 36.34,14.95 C28.2 | U$3.32 37.15,13.2 v37.6,13.65 | U$2.32 38,25.4 v38,25.55 | 31.9,21.9 U$2.16 31.77,21.52 | 31.77,21.52 31.58,21.33 C12.2 | v31.75,21.45 31.77,21.52 | 36.34,14.95 36.34,14.89 | v31.95,16.3 v31.94,16.31 R25.1
  Top 0.3: U$6.P$1 41.95,11.39 C51.1
  Top 0.305: C29.2 31.25,8.85 31.34,8.94 32.04,8.94 v32.05,9 32.05,9.5 U$3.16 | C40.1 v53.4,28.8 | L7.2 v52.4,28.8 | v37.6,13.65 38.25,14.3 C30.2
  Top 0.508: v38,25.55 v38.01,25.55 C14.2
  $VCC 0.61: 50.5,20.1 49.33,18.93 48.03,18.93 46.88,17.77 46.88,16.88 46.4,16.4
  $VCC 0.64: v52.4,28.8 52.95,28.8 | 52.95,28.8 v53.4,28.8 | 52.95,28.8 52.95,26.57 52.51,26.13 52.51,25.21 51.85,24.55 | 51.85,24.55 51.85,24.6 | 51.85,24.55 51.85,22.3 50.5,20.95 50.5,20.1 | 46.4,16.4 45.8,15.8 v45.8,15.75
  Bottom 0.64: v45.8,15.75 43.2,13.15 v42.95,13.15
  other vias: 41.65,12.5 42.3,12.5 42.95,12.5 41.65,13.15 42.3,13.15 43,11.8
  pour $VCC: 31.5,8.55 31.5,29.95 40.55,30 40.6,25 42.75,22.85 42.8,14.9 43.4,14.25 43.4,10.3 41.7,8.6
  pour Top (no thermals): 41.3,11.1 41.3,13.45 43.35,13.45 43.35,11.7 42.75,11.1
3.3VD  (via drill 0.3)
  Top 0.152: C6.1 18.36,23.16 18.35,23.15
  Top 0.203: C4.1 18.37,11.12 18.4,11.09
  Top 0.254: U$1.52 18.35,23.15 18.35,23.29 | R23.1 21.54,25.21 | U$1.29 18.35,11.9 v18.4,11.85 18.4,11.09
  Top 0.406: 21.54,25.21 arc-90 21.58,25.25 v22.2,25.25
  $VCC 0.813: 24.9,9.15 24.35,9.15
  Bottom 0.64: v23.35,9.13 v25,9.13 v26,9.13 27.2,9.13 28.13,8.2 35,8.2 35.69,7.51 35.69,5.39 U$5.17
  other vias: 18.45,24.8 19.05,24.75 24.15,9.13
  pour Top (no thermals): 18.3,23.3 18.3,24.95 19.2,24.95 19.2,24.7 18.8,24.3 18.8,23.3
  pour $VCC: 17.7,8.85 17.7,11.9 18.1,12.45 20.75,12.45 22.8,14.5 22.8,20.7 19.1,24.4 18,24.4 18,27.65 26.3,27.65 26.3,8.85
3.3VD_GPS  (via drill 0.3)
  Top 0.254: U$9.P$5 42.4,28.8 v41.9,29.3
  Top 0.406: 49.35,7.9 GPS.8
  Top 1.016: U$5.1 54.65,6.75 50.61,6.75 49.45,7.91 49.35,7.91
  $VCC 1.27: v49.5,9 v49.5,10.05 49.5,12.7 48,14.2 45,14.2 43.75,15.45 43.75,23.35 43.23,23.88 42.15,24.95 42.15,26.1
  other vias: 41.75,26.85 42.4,26.25 41.75,26.25
  pour $VCC: 41.15,26.05 41.15,30 42.65,30 42.65,26.05
  pour Top (no thermals): 41.15,26.05 41.15,27.6 42.65,27.65 42.65,26.05
  pour Top (no thermals): 46.3,8.55 46.3,10.5 49.75,10.45 49.75,7.55 47.85,7.55 46.85,8.55
5V  (via drill 0.3, 0.55)
  Top 0.254: 7.9,9.6 7.9,9.04 8,8.95 8,8.45 7.65,8.1 7.15,8.1 7.06,8.2 U1.5 | U$6.P$4 39.9,8.55 v39.9,8.6 | C50.1 42.06,6.96 | 42.06,6.96 v41.75,6.8 | 42.06,6.96 42.27,6.8 v42.4,6.8
  Top 0.3: U$6.P$6 41.95,7.66 C50.1
  Top 0.64: v9.95,7.2 9.95,8.25 8.6,9.6 7.9,9.6 7.4,9.6
  $VCC 0.254: 39.8,8.6 v39.9,8.6 40.15,8.6 40.65,8.1 40.65,7.24 40.61,7.2 41.2,7.2 v41.75,6.8 41.75,6.89
  $VCC 1.27: U$5.4 U$5.2 57.83,2.23 59,3.4 59,6.1 57.9,7.2 40.61,7.2 40.31,6.89 35.55,6.89 34.65,7.79 33.75,7.79 33.16,7.2 v9.95,7.2
  pour Top (no thermals): 6.15,11.4 6.15,10.25 6.7,9.7 6.7,9.15 7.95,9.2 7.95,10.8 7.35,11.4
CLKO_B
  Top 0.254: U$3.10 27.6,12.6 25.75,14.45 25.75,17.95 24.98,18.72 24.27,18.72 R18.1
CS  (via drill 0.3)
  Top 0.254: R27.1 v7.65,19 | v34.2,6.7 33.65,6.7 33.52,6.57 31.19,6.57 29.91,5.29 29.91,4.26 29.9,4.26 29.9,3.3 28.83,2.23 U$5.24
  Bottom 0.254: v7.65,19 7.02,18.37 7.02,14.01 13.04,7.99 26.68,7.99 27.48,7.19 33.71,7.19 v34.2,6.7
FEWF
  Top 0.178: R11.2 D4.+
GND  (via drill 0.33)  (486 unrouted)
  Top 0.178: 12.85,16.55 12.85,16.2 12.77,16.12
  Top 0.254: 12.7,14.2 12.7,14.3 12.8,14.3 12.85,14.25 | U$1.7 12.72,18.22 12.75,18.25 12.85,18.15 12.85,16.55 12.68,16.72 U$1.10 10.87,16.72 v10.65,16.5 10.93,16.22 U$1.11 12.68,16.22 12.77,16.12 12.85,16.05 12.85,14.25 | U$1.24 15.85,14.55 | 15.85,14.55 18.65,14.55 | 18.65,14.55 18.85,14.35 U$1.30 18.85,12.25 19.05,12.05 | U$1.40 19.28,17.22 | 19.28,17.22 19.25,17.25 | 18.65,14.55 18.65,14.8 | 18.65,14.8 18.65,16.59 | 18.65,16.59 19.28,17.22 | 19.48,17.72 19.35,17.95 19.35,20.15 19.25,20.25 19.45,20.45 19.45,20.75 19.65,20.95 | U$1.48 19.92,21.22 19.65,20.95 | U$1.51 18.85,20.55 18.95,20.55 19.35,20.95 19.35,22.05 19.75,22.05 19.85,21.95 19.85,21.25 19.65,21.05 19.65,20.95 | U$1.41 19.48,17.72 | 19.48,17.72 19.38,17.72 19.25,17.85 16.75,17.85 16.25,17.35 16.15,17.35 16.05,17.45 | 12.85,14.25 15.55,14.25 15.85,14.55 | 18.65,16.59 16.98,16.59 U$1.65 16.1,19.4 14.85,20.65 U$1.59 14.85,22.05 | 19.35,12.1 U$1.31 19.35,14.05 18.65,14.8 | U$1.32 19.85,11.9 20.05,11.7 20.55,12.2 20.55,12.8 20.45,12.9 19.95,12.9 19.85,13 19.85,13.7 | 20.65,13.7 19.85,13.7 | 19.85,13.7 19.35,14.2 | 5.8,8.7 U1.3 | U1.PAD 5.8,8.7 | 5.8,8.7 U1.6 | C39.2 53.24,27.4 arc-90 C40.2
  Top 0.28: 35.95,10.1 38.1,10.1 | 35.65,22.4 37.5,22.4 | 36.15,11.1 37.9,11.1 | 36.2,12.6 38,12.6 | 33.4,12.9 33.4,14.7 | 34.9,12.9 34.9,14.7 | 33.4,25.3 33.4,27.1 | 34.9,25.3 34.9,27.1 | 38,23.4 35.9,23.4 | 38.1,23.4 38.2,23.4
  other vias: 37.65,29.35 36.5,29.35 35.35,29.35 33.95,29.35 34.65,23.65 34.65,11.35 29.55,9 38.9,10.3 27.15,16.1 27.15,18.7 28.05,19.5 24.05,17.8 22.05,23.8 20.65,22 20.5,24.5 7.65,17 7.65,18 6.45,2.95 5.8,8.25 4.9,11.9 36.25,19.1 35.5,20 19.3,11.95 34.75,14.85 33.25,14.85 20.85,12.6 20.05,11.65 12.95,14.3 13.75,14.3 12.95,15.1 13.75,15.1 14.55,14.3 14.55,15.1 12.95,15.9 13.75,15.9 12.95,16.7 13.75,16.7 14.55,15.9 14.55,16.7 12.95,17.5 13.75,17.5 12.95,18.3 13.75,18.3 14.55,17.5 14.55,18.3 12.95,19.1 13.75,19.1 12.95,19.9 13.75,19.9 14.55,19.1 14.55,19.9 12.95,20.7 13.75,20.7 14.55,20.7 17.75,14.3 18.55,14.3 17.75,15.1 18.55,15.1 19.35,14.3 19.35,15.1 17.75,15.9 18.55,15.9 17.75,16.7 18.55,16.7 19.35,15.9 19.35,16.7 17.75,17.5 18.55,17.5 17.75,18.3 18.55,18.3 19.35,17.5 19.35,18.3 17.75,19.1 18.55,19.1 17.75,19.9 18.55,19.9 19.35,19.1 19.35,19.9 17.75,20.7 18.55,20.7 19.35,20.7 15.35,14.3 16.15,14.3 15.35,15.1 16.15,15.1 16.95,14.3 16.95,15.1 15.35,15.9 16.15,15.9 15.35,16.7 16.15,16.7 16.95,15.9 16.95,16.7 15.35,17.5 16.15,17.5 15.35,18.3 16.15,18.3 16.95,17.5 16.95,18.3 15.35,19.1 16.15,19.1 15.35,19.9 16.15,19.9 16.95,19.1 16.95,19.9 15.35,20.7 16.15,20.7 16.95,20.7 14.3,25.8 15.5,9.2 30.95,16.2 28.35,20.25 8.15,24.55 20.85,11.7 0.85,11.6 0.85,14 48.95,16.35 45.6,8.7 5.8,8.95 7.4,8.7 20.05,10.95 9.85,13.05 11.55,13.05 28.05,15.3 37.35,17.3 36.35,17.3 35.25,17.3 33.85,17.3 27.15,19.95 38.15,22.1 38.1,11.45 38.2,10.05 52.9,14.65 54.9,14.65 51.4,14.65 50.7,16.85 51.9,17.1 56.95,17.95 28.7,9 27.85,9.65 27.6,20.65 7.8,7.25 5.8,9.6 11.55,22 9.6,13.85 8.65,13.85 20.3,23.2 33.25,9.95 36.05,9.95 36.05,11.35 36.05,12.75 34.65,12.75 34.65,9.95 33.25,12.75 33.25,11.35 34.65,25.05 36.05,25.05 36.05,23.65 36.05,22.25 34.65,22.25 33.25,22.25 33.25,23.65 33.25,25.05 33.35,27.15 34.75,27.15 38.35,15.9 38.65,12.85 38.85,13.6 38.5,21.25 38.65,23.25 38.8,16.75 40.55,12.55 41.3,9.55 42.1,9.55 40.45,9.55 39.35,8 39.7,27.5 40.45,26.7 39.7,28.5 40.45,29.3 43.85,27.8 43.85,27 43.85,26.25 43.85,28.6 43.85,29.3 43.25,28.2 44.45,28.2 43.25,27.4 44.45,27.35 43.25,28.95 44.45,28.95 43.25,26.6 44.45,26.6 48.45,29.2 49.85,26.8 49.65,27.5 53.3,25.8 7.8,6.55 58.4,17.75 58.4,20.85 57.95,18.7 57.95,19.75 58.85,24.5 57.5,28.9 56.95,29.35 55.95,28.4 55.95,29.25 45.65,22.45 48.2,25.35 46.9,19.35 49.1,25.35 61.95,10.4 61.95,12.05 62.7,11.2 55.65,24.7 58.2,26.85 55.8,27.6 59.2,28.5 56.15,21.35 57.6,20.85 58.05,23.5 53.65,22.9 53.65,21.85 54.75,21.85 54.75,22.9 54.75,23.95 53.65,23.9 52.7,21.85 52.7,22.9 52.7,23.9 51.2,25.55 10.95,11.65 44.8,8.7 18.4,27.4 18.4,26.6 20.3,23.9 38.05,8.35 50.8,17.8 50.65,18.85 51.65,20.9 49.7,20.6 48.85,20.6 49.85,18.15 48.9,18.15 45.75,21.2 47.65,17.45 44.9,17.6 44.9,20.55 40.7,18.3 46.85,21.2 40.8,15.6 45.8,17.45 40.85,23.15 40.85,25.15 42.45,22.25 44.9,22.25 45.4,25.35 43.55,25.35 46.25,25.35 47.2,25.35 47.45,26.2 46.5,22.9 47.7,22.9 47.1,22.05 45.35,26.15 59,23.5 60,23.5 60.8,21.75 60.8,20.9 54.6,16.4 55.85,17.1 52.75,16.4 53.55,19.5 54.2,19.5 61.3,20.4 62.15,20.4 63,20.4 63.85,20.4 61.3,13.2 62.15,13.2 63,13.2 63.85,13.2 60.3,13.2 60.15,13.95 60.15,14.7 60.15,15.55 58.4,16.85 58.65,16.05 1.95,11.6 3.95,11.25 0.75,2.9 2.9,0.8 6.5,0.7 4.95,0.7 1.45,1.4 4.95,2.95 2.9,2.95 61.35,3.6 62.45,3.6 63.6,3.55 61.35,8.35 62.4,8.35 63.6,8.35 64.3,7.05 64.3,4.8 60.7,4.55 60.7,7.35 0.85,16.5 0.85,18.95 0.85,21.4 0.85,23.75 61.3,22.65 60.9,23.5 59.3,15.65 58.85,25.3 56.7,27.7 58.7,26.2 57.6,27.5 58.35,28.5 53.5,17.05 53.85,18.3 39.2,22.9 39.55,22.05 39.8,21.15 40.1,20.1 39.5,17.65 39.25,18.5 39,19.4 38.7,20.3 40.4,19.1 38.4,12.1 39.25,14.95 39.5,15.85 39.35,10.9 39.55,11.6 39.8,12.4 40,13.2 40.25,13.95 40.5,14.75 55.2,26.85 5.85,25.9 8.1,25.9 5.85,27.6 5.85,29.3 8.1,27.55 8.1,29.3 10.3,27.55 10.3,29.3 12.8,29.25 55.75,25.4 58.05,24.2 56.35,24.05
  pour Bottom: -0.1,30.4 0.1,0.15 64.95,0 65,30
  pour Top (rank 2): -0.05,30 0.1,0.15 64.95,0 65,30
  pour $GND (no thermals): -0.1,0 65,0 65,30 -0.1,30
  pour Top (rank 2, no thermals): 67.6,12.65 67.6,31.5 40.95,31.35 41,25.75 37.15,25.7 37.15,17.75 38.45,17.8 38.45,16.15 59.4,16.15 59.4,12.55
  pour $VCC (rank 2): -0.1,0 -0.1,30 65,30 65,0
GPSRX
  Top 0.254: GPS.3 47.1,13.4 46.5,12.8 46.5,11.45 46.05,11 44.7,11 43.95,10.25 43.95,7.15 44.95,6.15 46.81,6.15 47.69,5.28 47.69,4.31 48.85,3.15 48.85,2.39 U$5.8
GPSTX
  Top 0.254: U$5.10 45.15,3.55 45.15,5.38 43.99,6.54 43.44,7.08 43.44,10.42 44.43,11.41 45.88,11.41 46.09,11.62 46.09,12.97 47.62,14.5 GPS.2
LNA_EN  (via drill 0.3)
  Top 0.254: U$1.14 10.45,14.72 v10.43,14.7
  Bottom 0.254: 10.4,14.7 v10.43,14.7 11.05,14.7 R5.1
MISO  (via drill 0.3)
  Top 0.254: R24.1 v7.6,21
  Bottom 0.254: v7.6,21 7.6,20.82 7.02,20.24 7.02,19.77 6.21,18.95 6.21,13.64 12.72,7.13 26.16,7.13 26.91,6.38 30.67,6.38 31.25,5.8 31.25,4.79 U$5.21
MOSI  (via drill 0.3)
  Top 0.254: R26.1 v7.6,20
  Bottom 0.254: v7.6,20 7.6,19.77 6.61,18.79 6.61,13.85 12.87,7.59 26.43,7.59 27.23,6.79 32.56,6.79 33.8,5.55 33.8,4.8 U$5.19
N$1  (via drill 0.3)
  Top 0.254: R30.1 v10.3,26.05 | 34.45,19.85 v34.65,19.65 34.4,19.9 U$2.20
  Bottom 0.254: v34.65,19.65 34.25,19.65 33.25,20.65 31.7,20.65 30.27,22.08 30.27,27.16 28,29.42 14.02,29.42 | v10.3,26.05 10.45,26.05 11.1,26.7 11.3,26.7 14.02,29.42 | 14.05,29.45 14.02,29.42
N$2
  Top 0.254: U$1.36 21.78,15.22 26.3,10.7 28.64,10.7 R45.2
N$3
  Top 0.254: U$1.37 22.28,15.72 R3.2
N$4
  Top 0.254: 24,15.2 R4.2 23.91,15.4 23.3,15.4 22.48,16.22 U$1.38
N$5
  Top 0.254: R34.2 25.05,21.65 22.62,19.22 U$1.44
N$6
  Top 0.254: U$1.46 21.72,20.22 22.65,21.15 22.82,21.15 R7.2
N$7
  Top 0.254: U$1.47 21.42,20.72 22.25,21.55 22.25,21.98 R8.2
N$8
  Top 0.254: R35.2 25.25,22.65 22.32,19.72 U$1.45
N$9
  Top 0.254: U$1.34 21.28,14.22 21.85,13.65 21.85,12.59 R9.2
N$10
  Top 0.254: U$1.6 10.5,18.72 9.78,18 R10.2
N$11
  Top 0.64: C20.2 L2.2
N$12  (via drill 0.3)
  Top 0.178: U$1.54 17.35,22.65 16.49,23.51 v16.49,27.6 | v4.56,13.44 4.56,12.76 R11.1
  Bottom 0.178: 14.39,24.25 14.94,24.25 16.49,25.8 v16.49,27.6 | 14.39,24.25 | 14.39,24.25 13.89,24.25 12.31,22.67 7.5,22.67 5.28,20.45 5.28,14.1 4.62,13.44 v4.56,13.44
N$13  (via drill 0.3)
  Top 0.178: U$1.55 16.85,22.65 16.15,23.35 16.15,27.17 v15.75,27.57
  Top 0.254: v4.5,16 R12.1
  Bottom 0.178: 14.53,24.58 14.8,24.58 15.89,25.66 15.89,27.39 15.75,27.53 v15.75,27.57 | 14.53,24.58 | 14.53,24.58 13.75,24.58 12.17,23 7.37,23 4.94,20.57 4.94,19.31 4.95,19.3 4.95,16.45 v4.5,16
N$14  (via drill 0.3)
  Top 0.152: R13.1 4.39,17.9
  Top 0.178: U$1.56 16.35,22.65 15.75,23.25 15.75,26.56 v15.35,26.97 | 4.36,18.02 v4.36,18.48
  Top 0.254: 4.39,17.9 4.36,17.93 v4.36,18.48
  Bottom 0.178: v15.35,26.97 15.19,26.81 15.19,25.43 14.67,24.91 13.61,24.91 12.03,23.33 7.23,23.33 4.61,20.71 4.61,18.73 v4.36,18.48
N$15  (via drill 0.3)
  Top 0.178: U$1.57 15.85,22.65 15.35,23.15 15.35,26.16 v14.54,26.97 | v4.51,21.4 4.51,20.2 R14.1
  Bottom 0.178: v14.54,26.97 14.54,26.35 14.86,26.03 14.86,25.57 14.53,25.24 13.48,25.24 11.9,23.66 7.09,23.66 4.83,21.4 v4.51,21.4
N$16  (via drill 0.3)
  Top 0.178: U$1.58 15.35,22.6 14.95,23 14.95,25.94 14.48,26.41 13.96,26.41 v13.84,26.52 | v5.11,22.65 R15.1
  Bottom 0.178: v13.84,26.52 13.59,26.27 13.59,25.82 11.76,23.99 6.95,23.99 5.61,22.65 v5.11,22.65
N$17
  Top 0.3: U$10.8 57.21,26.69 arc90 56.9,27 56.55,27 arc70 55.7,26.35 arc-63 54.85,25.7 arc82 54.4,25.25 U2.20
N$18
  Top 0.178: R12.2 D3.+
N$19
  Top 0.178: R14.2 D1.+
N$20
  Top 0.178: R15.2 D0.+
N$21
  Top 0.178: R13.2 2.42,17.8 D2.+
N$22
  Top 0.254: U$1.39 23.07,16.72 23.09,16.71 R16.1
N$23
  Top 0.152: U$7.P$2 42.38,24.15
  Top 0.55: 42.38,24.15 U13.P$2
N$25
  pour Top (no thermals): 5.1,9 0.5,9 0.5,10.65 3.8,10.65 4.1,10.35 4.1,9.6 4.4,9.35 5.1,9.3
N$26
  Top 0.254: U$5.40 8.09,1.95 R47.2
N$27
  Top 0.406: L6.1 59.99,8.35 R2.1 C21.1
N$28  (via drill 0.3)
  Top 0.254: v50.09,22.9 50.46,22.54 51.04,22.54 51.13,22.62 U2.4
  Bottom 0.254: v50.09,22.9 47.14,19.95 46.65,19.95 46.25,19.54 46.25,18.98 46.99,18.24 46.99,15.26 43.99,12.26 43.99,10.02 40.97,7 37.05,7 35.25,8.8 33.07,8.8 31.63,10.25 27.6,10.25 27.09,9.73 23.1,9.73 22.18,8.81 17.96,8.81 15.86,10.9 15.3,10.9 15.23,10.97 15.21,10.97 14.93,11.24 C36.2 R1.2
N$29
  Top 0.305: U$2.8 32.9,26.5 32.63,26.77 C19.1
N$30
  Top 0.178: U$1.53 17.85,22.75 arc37 17.45,23.65 arc-44 R21.2
N$31
  Top 0.152: OSC1.3 17.47,25.63 17.45,25.61
  Top 0.406: 17.45,25.61 R21.1
N$32
  Top 0.3: R22.2 19.59,27.24 19.55,27.2 19.41,27.34 OSC1.1
N$33
  Top 0.152: OSC1.4 19.47,25.84 19.77,26.14
  Top 0.254: R22.1 21.47,26.15 21.45,26.15
  Top 0.3: R23.2 21.45,26.15 20.48,26.15 C10.1 19.77,26.14
N$34
  Top 0.406: R2.2 GPS.14
N$35
  Top 0.254: 36.4,26.5 U$2.1 36.4,26.62 C11.1
N$36
  Top 0.152: OSC2.P$4 30.2,18.7
  Top 0.254: R25.2 31.06,17.88 C18.1 arc10 30.65,18.25 30.2,18.7
N$37  (via drill 0.3)
  Top 0.152: OSC2.P$3 29.63,16.05 29.61,16.02
  Top 0.254: v27.55,14.35 27.55,14.4 27.59,14.36 C34.2 29.61,16.02 | C19.2 29.16,25.4 v27.8,25.4
  Bottom 0.254: v27.8,25.4 26.5,24.1 26.5,15.3 27.45,14.35 v27.55,14.35
N$38
  Top 0.305: C15.1 U$2.25
N$39
  Top 0.254: U$2.3 35.4,27.95 C16.1
N$40
  Top 0.254: U$2.5 34.4,26.65 34.15,26.9 34.15,27.96 C17.1
N$41
  Top 0.64: GPS.11 58.3,7.9 arc-45 59.15,7.55 arc4 L6.2 60.78,5.9 ANT1.D
N$42
  Top 0.254: U2.5 50.92,22.12 50.5,21.7 50.04,21.7 R19.2
N$43
  Top 0.254: U$1.2 10.68,20.72 9.4,22 R17.2
N$44
  Top 0.64: U$4.P$5 45.77,19.34 C22.1 43.61,19.34 C20.1
N$45
  Top 0.254: U$1.43 23.23,18.72 R18.2
N$46
  Top 0.64: U$4.P$2 C2.2
N$47
  Top 0.254: GPS.9 46.75,6.8 SJ1.1
N$48
  Top 0.254: U$1.3 10.38,20.22 9.6,21 R24.2
N$50
  Top 0.254: U$1.4 10.08,19.72 9.8,20 R26.2
N$51  (via drill 0.3)
  Top 0.254: U2.3 50.95,23.12 arc90 v50.8,23.12
  Bottom 0.254: v50.8,23.12 50.7,23.12 50.34,23.48 49.85,23.48 49.51,23.14 49.51,22.89 46.97,20.35 46.48,20.35 45.84,19.71 45.84,18.76 46.58,18.02 46.58,15.43 44.4,13.25 43.58,12.43 43.58,10.19 40.8,7.4 37.22,7.4 35.42,9.21 34.34,9.21 33.85,9.7 33.85,10.2 33.39,10.65 27.43,10.65 26.93,10.15 22.95,10.15 22.01,9.21 18.5,9.21 16.03,11.68 16.03,11.79 14.68,13.14 C55.2 R5.2
N$52
  Top 0.152: U$7.P$5 44.69,24.15
  Top 0.305: R29.2 45.61,24.15 45.6,24.15
  Top 0.64: 44.69,24.15 45.6,24.15 R28.1
N$53
  Top 0.254: U$8.P$2 55.65,18.3 arc90 55.95,18.6 55.95,19.7 arc90 55.5,20.15 54.7,20.15 arc-90 54.4,20.5 U2.11 arc-90 U2.11
N$54
  Top 0.254: U2.9 53.41,20.55 arc-90 53,20.15 51.85,20.15 arc90 51.45,19.75 51.45,18.65 arc90 51.8,18.3 U$8.P$5
N$56
  Top 0.152: R34.1 29.83,21.65 29.88,21.7
  Top 0.254: U$2.15 30.58,22.4 29.88,21.7 29.7,21.7
N$57
  Top 0.254: U$2.14 29.89,22.9 R35.1
N$58
  Top 0.254: U$3.1 36.4,14.1 37.35,15.05 37.35,15.7 C27.1
N$59
  Top 0.305: C31.1 U$3.25
N$60
  Top 0.254: U$3.3 35.4,15.57 C32.1
N$61
  Top 0.254: U$3.5 34.4,14.35 33.9,14.85 33.9,15.7 C33.1
N$62
  Top 0.305: U$3.8 32.9,14.25 32.75,14.4 30.53,14.4 C34.1
N$64
  Top 0.254: C2.1 50.3,19.8 arc19 50.75,20.5 arc13 50.9,21 arc-85 U2.6
N$65
  Top 0.254: U2.14 56.73,22.12 C23.1
  Top 0.64: C23.1 57.25,22.14 L3.1 C25.1 57.26,22.14 C23.1
N$66
  Top 0.64: C25.2 L5.1 C24.1 | C24.1 L3.2 C25.2 | C25.2 C24.1
N$67
  Top 0.64: 59.6,19.65 59.6,18.55 | 59.6,19.65 L5.2 | 59.6,18.55 C37.1 | D5.2 59.6,18.55 | C26.1 59.6,19.65
N$68
  Top 0.64: R28.2 R36.2 arc-2 C38.1
N$69
  Top 0.254: C38.2 50.9,23.8 arc31 51.2,23.65 arc16 U2.2
N$70
  Top 0.406: C37.2 X3.P
  pour Top: 60.8,16.45 60.4,16.8 60.8,17.15
N$71
  Top 0.254: L7.1 arc-90 52.41,27.3 C39.1 52.5,26.3 52.5,25.75 52.91,25.34 U2.23
N$72
  Top 0.254: U2.12 55.72,20.92 R37.1
N$73
  Top 0.3: 55.92,23.12 U2.16 56.22,23.12 arc90 57.21,24.11 U$10.4
N$74
  Top 0.406: C46.1 53.98,29.25 53.77,29.46 51.91,29.46 51.6,29.15 50.39,29.15 L9.1
  Top 0.64: 50.39,29.15 50.35,29.11 C41.1 L8.2 | C46.1 C45.1 L10.2
N$75
  Top 0.254: L8.1 C44.1 52.41,25.24 U2.24
N$76
  Top 0.254: D6.+ R47.1
N$77
  Top 0.254: U2.21 53.91,25.95 54.4,26.45 L10.1
N$78
  Top 0.254: U$3.15 29.91,10.1 R44.1
N$79
  Top 0.254: U$3.14 29.84,10.6 R45.1
N$80
  Top 0.254: U$1.61 13.85,23.1 13.3,23.65 R33.2
N$81
  Top 0.152: R32.2 12.3,24.26 12.35,24.3
  Top 0.254: U$1.62 13.35,22.85 12.35,23.85 12.35,24.3
N$82
  Top 0.254: U$1.63 12.85,22.65 12.05,23.45 11.7,23.45 11.3,23.85 R31.2
N$83
  Top 0.254: U$1.64 12.35,22.35 11.85,22.85 11.3,22.85 10.3,23.85 R30.2
N$84
  Top 0.254: U$1.22 14.85,10.99 R43.2
N$85
  Top 0.254: R42.2 13.8,10.95 13.8,10.96 14.35,11.5 U$1.21
N$86
  Top 0.254: U$1.20 13.85,11.95 13.2,11.3 12.7,11.3 12.45,11.05 R41.2
N$87
  Top 0.254: U$1.19 13.35,12.25 12.81,11.71 12.53,11.71 12.52,11.7 12,11.7 11.45,11.15 R40.2
N$88  (via drill 0.3)
  Top 0.254: U$3.9 28,13.1 v27.85,13.25 | v23.45,11.25 22.25,10.05 17.05,10.05 16.35,10.75 U$1.25 | v26.4,24.98 v26.39,24.98 26.56,24.82 30.96,24.82 31.54,25.4 U$2.9
  Bottom 0.254: v23.45,11.25 24.45,12.25 26.85,12.25 v27.85,13.25 27.83,13.27 27.81,13.27 26.09,14.98 26.09,24.37 26.4,24.68 v26.4,24.98
N$89  (via drill 0.3)
  Top 0.254: U$2.11 25.8,24.4 25.65,24.55 v25.65,24.75 | v24.85,16.75 24.21,16.75 R16.2
  Bottom 0.254: v25.65,24.75 25.65,17.55 v24.85,16.75
N$90
  Top 0.254: U$1.35 21.7,14.72 26.13,10.29 28.25,10.29 R44.2 28.45,10.1
N$91
  Top 0.254: U$2.13 25.07,23.4 R7.1
N$92
  Top 0.254: U$3.13 30.35,11.1 30,11.46 26.54,11.46 R3.1
N$93
  Top 0.254: U$3.12 30.43,11.6 30.16,11.86 27.45,11.86 R4.1
N$94
  Top 0.254: U$2.12 24.17,23.9 R8.1
N$95
  Top 0.254: U2.1 50.18,25.65 49.64,25.65 C56.2
  Top 0.3: R46.2 49.14,26.86 C56.2
N$96
  Top 0.2: R38.1 R39.2
  Top 0.254: U$9.P$3 R38.1
N$97
  Top 0.254: U$1.5 10.12,19.22 9.9,19 R27.2
N$98
  Top 0.254: U$9.P$6 41.74,28.15 arc-90 C52.1
N$100  (via drill 0.3)
  Top 0.254: R31.1 v11.3,26.05 | 33.95,19.15 v34.15,18.95 33.9,19.2 U$2.19
  Bottom 0.254: v34.15,18.95 32.95,20.15 31.55,20.15 29.86,21.84 29.86,26.99 27.84,29.01 14.26,29.01 v11.3,26.05
N$101  (via drill 0.3)
  Top 0.203: R32.1 12.25,25.15
  Top 0.254: 12.25,25.15 v12.25,26.05 | 33.35,19.05 v33.25,18.95 33.4,19.1 U$2.18
  Bottom 0.254: v33.25,18.95 33.05,18.95 32.35,19.65 31.35,19.65 29.46,21.54 29.46,26.82 27.67,28.61 14.43,28.61 12.27,26.44 12.27,26.07 v12.25,26.05
N$102  (via drill 0.3)
  Top 0.152: R33.1 13.2,25.2
  Top 0.254: 13.2,25.2 13.05,25.35 v13.05,26.05 | v32.1,19.05 32.35,19.05 32.9,19.6 U$2.17
  Bottom 0.254: v32.1,19.05 31.25,19.05 29.05,21.25 29.05,26.65 27.5,28.2 14.6,28.2 13.05,26.65 v13.05,26.05
N$103
  Top 0.254: R40.1 11.8,9.35 11.8,9.34 14.12,7.02 33.4,7.02 34.4,8.03 U$3.20
N$104
  Top 0.254: R41.1 12.8,9.35 12.8,9.34 14.72,7.43 33.23,7.43 33.9,8.1 U$3.19
N$105
  Top 0.254: R42.1 13.45,9.3 14.91,7.84 33.04,7.84 33.4,8.2 U$3.18
N$106
  Top 0.254: R43.1 14.45,8.95 15.16,8.24 32.79,8.24 32.9,8.35 U$3.17
PA_EN  (via drill 0.3)
  Top 0.254: U$1.15 10.77,14.22 10.67,14.12 10.57,14.12 v10.45,13.99
  Bottom 0.254: v10.45,13.99 10.45,14.05 10.75,13.75 | R1.1 11.55,12.3 11.15,12.3 10.75,12.7 10.75,13.75 | 10.75,13.75
PPS  (via drill 0.3)
  Top 0.254: U$1.9 10.47,17.22 9.61,16.35 8.7,16.35 8.6,16.25 8.6,15.62 R20.2 8.04,15.59 8.02,15.6 v7.9,15.6 | GPS.4 v47.25,12.3 | v45.51,12.3 45.03,11.81 44.26,11.81 43.04,10.59 43.04,6.39 42.64,5.99 38.35,5.99 37.63,5.28 37.63,3.55 U$5.18
  Bottom 0.254: v7.9,15.6 8.05,15.45 8.05,13.55 13.21,8.4 26.95,8.4 27.75,7.6 34.75,7.6 35.09,7.26 35.09,4.26 36.31,3.05 U$5.18 | v47.25,12.3 v45.51,12.3
RST
  Top 0.152: R6.1 9.05,23.01 9.05,23
  Top 0.254: 11.18,21.22 U$1.1 10.98,21.22 10,22.2 10,22.7 9.7,23 9.05,23 | R6.1 8.44,22.65 7.42,22.65 6.9,22.12 6.9,13.25 13.53,6.62 26.73,6.62 27.47,5.88 27.47,1.73 28.18,1.01 29.99,1.01 30,1 U$5.22
RX
  Top 0.254: U$3.27 37.7,10.6 arc71 38.9,11.55 L1.2 38.95,21.95 arc74 37.7,22.9 U$2.27
  Top 0.64: L2.1 L1.2
SCK  (via drill 0.3)
  Top 0.254: R17.1 v7.6,22
  Bottom 0.254: v7.6,22 6.57,20.97 6.57,20.02 5.75,19.2 5.75,13.61 5.8,13.56 5.8,13.48 12.55,6.73 25.89,6.73 26.51,6.11 26.61,6.11 26.74,5.97 27.49,5.97 U$5.23
TX_N
  Top 0.254: U$2.29 39.1,23.9 39.85,23.15 U13.P$6
TX_P
  Top 0.254: U$2.30 39.1,24.4 39.85,25.15 U13.P$4
VCC_FEM
  Top 0.64: 45.3,27.15 45.3,27.14 C54.1 47.64,27.14 47.64,28.11 R38.2 R46.1 49.46,28.7 L9.2
  pour Top (no thermals): 45.1,26.8 45.1,27.5 45.55,27.5 45.55,26.8

### Text on the board
tPlace: RX_NOT_EMP | RF | SEN_PKT | BH_PKT | FSK_PKT | TX_ON | GPS
bNames: LoRa Gateway for Raspberry Pi Zero V1.3 / design by Will Whang / 2018/03/15